# EAGLE board board (EAGLE 9.6.1), part 1 of 2
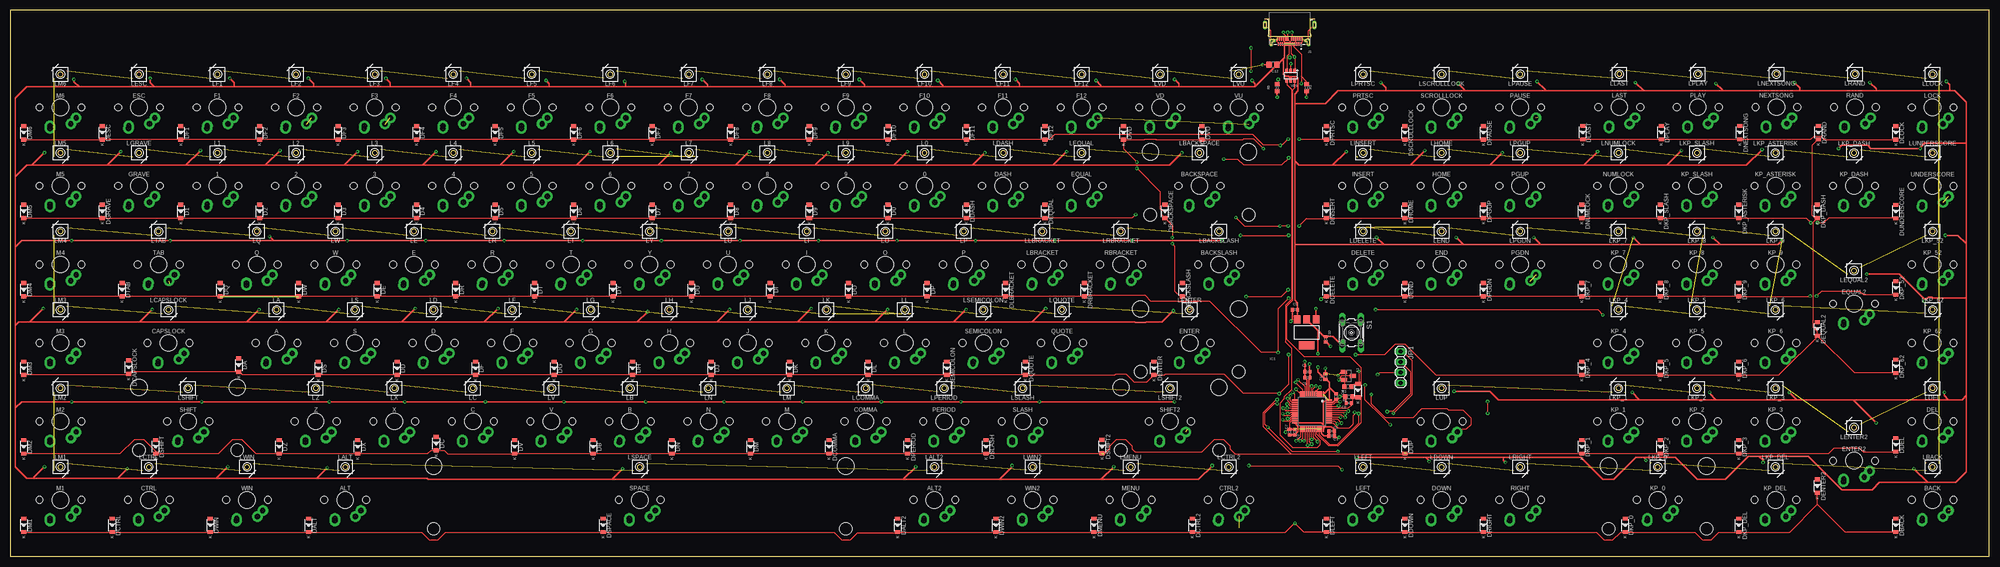
[diagram p5: board, top side]
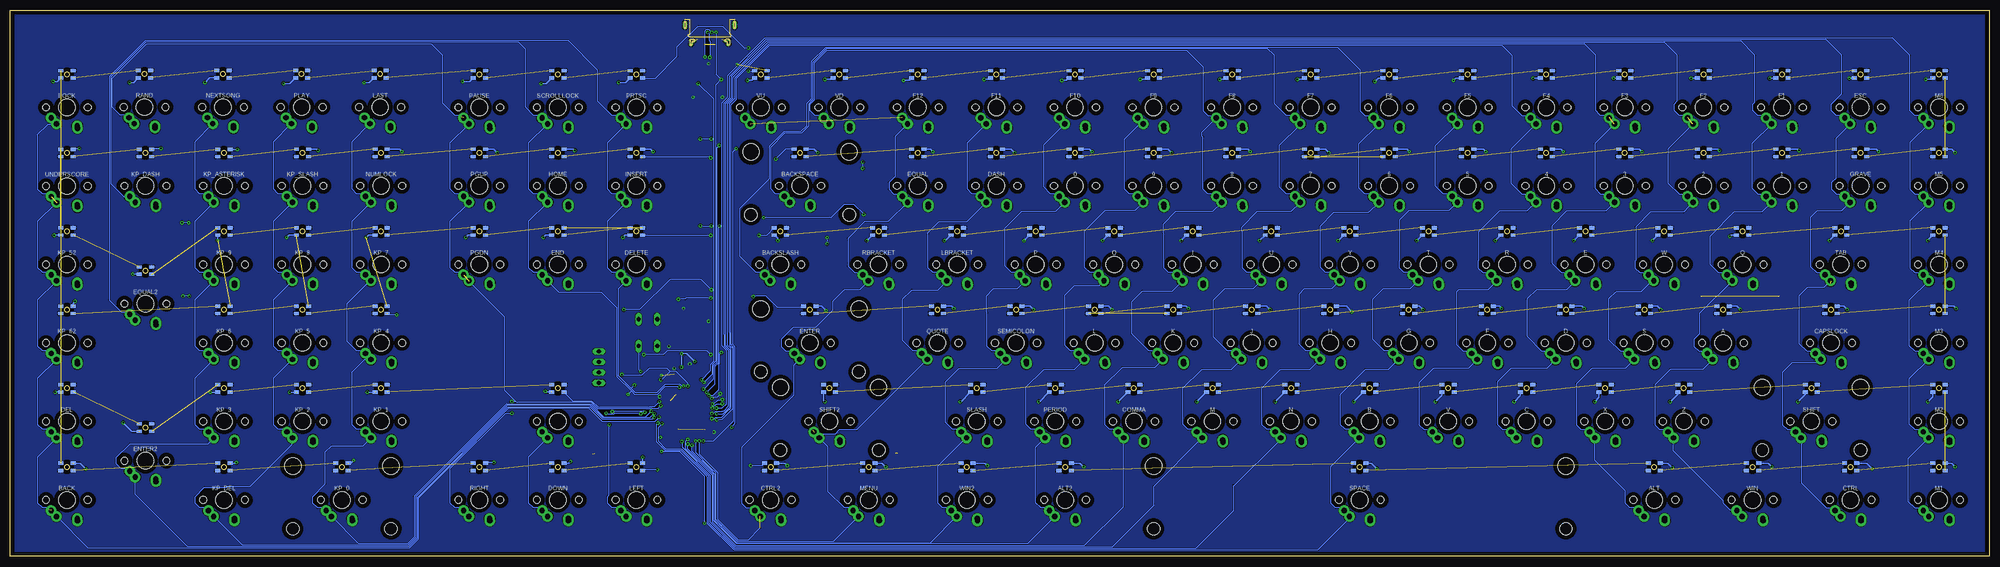
[diagram p6: board, bottom side, seen from below]

Size 479.92 x 132.49 mm. Coordinates in mm from the lower left corner, seen from the top.
Outline: 0,0 479.91,0 479.92,132.49 0.02,132.49 0,0
Copper layers (1*16): Top 0.035mm / dielectric 1.5mm / Bottom 0.035mm
Design rules "default": minimum track width 6mil, minimum drill 0.35mm, track to track 6mil, track to pad 6mil, pad to pad 6mil, via to via 6mil, smd to smd 6mil, copper to edge 40mil, drill to drill 6mil, minimum pad ring 10mil, minimum via ring 8mil, stop-mask expansion 4mil, vias tented up to drill 0mil, thermal gap 10mil
Net classes: 1 POWER: width 0.406 mm

## Footprints (pad centres in the part's own frame; a part is rotated, then mirrored left to right if it is on the bottom)
ALPSMX-1U = drill 1.3 pad 2.54: ALPS1 -2.5,4; ALPS2 2.5,4.5; MX1 -3.81,2.54; MX2 2.54,5.08 | hole 4: 0,0 | hole 1.7: -5.08,0; 5.08,0
ALPSMX-2U = drill 1.3 pad 2.54: ALPS1 -2.5,4; ALPS2 2.5,4.5; MX1 -3.81,2.54; MX2 2.54,5.08 | hole 4: 0,0; -11.9,-8.24; 11.9,-8.24 | hole 1.7: -5.08,0; 5.08,0 | hole 3.05: -11.9,7; 11.9,7
C0402 = smd 0.7 x 0.9: 1 -0.65,0; 2 0.65,0
C0805 = smd 1.3 x 1.5: 1 -0.95,0; 2 0.95,0
SOD-123 = smd 0.91 x 1.22: A -1.635,0; C 1.635,0
SOT223 = smd 1.499 x 2.007: 1 -2.261,-3.15; 2 0.025,-3.15; 3 2.311,-3.15 | smd 3.81 x 2.007: 4 0,3.15
TE_1-2295018-2 = smd 0.3 x 0.8: A1 -2.75,4.63; A2 -2.25,4.63; A3 -1.75,4.63; A4 -1.25,4.63; A5 -0.75,4.63; A6 -0.25,4.63; A7 0.25,4.63; A8 0.75,4.63; A9 1.25,4.63; A10 1.75,4.63; A11 2.25,4.63; A12 2.75,4.63; B1 3,3.43; B2 2.5,3.43; B3 2,3.43; B4 1.5,3.43; B5 1,3.43; B6 0.5,3.43; B7 -0.5,3.43; B8 -1,3.43; B9 -1.5,3.43; B10 -2,3.43; B11 -2.5,3.43; B12 -3,3.43 | drill 0.5 long: P1_1 -4.55,4.22; P2_1 4.55,4.22 | drill 0.35 long: P1_2 -4.191,3.795; P2_2 4.191,3.795 | drill 0.5 pad 1.1 long: P4 -5.97,0; P5 5.97,0
1X04 = drill 1.016 long: 1 -3.81,0; 2 -1.27,0; 3 1.27,0; 4 3.81,0
WS2812B-MINI = smd 0.8 x 1.2 bottom: DIN 0.89,-1.49; DOUT -0.89,1.49; GND -0.89,-1.49; VDD 0.89,1.49
R0603 = smd 1 x 1.1: 1 -0.85,0; 2 0.85,0
B3F-10XX = drill 1.016 long: 1 -3.251,2.261; 2 3.251,2.261; 3 -3.251,-2.261; 4 3.251,-2.261
ALPSMX-6.25U = drill 1.3 pad 2.54: ALPS1 -2.5,4; ALPS2 2.5,4.5; MX1 -3.81,2.54; MX2 2.54,5.08 | hole 4: 0,0; -50,-8.24; 50,-8.24 | hole 1.7: -5.08,0; 5.08,0 | hole 3.05: -50,7; 50,7
SOT23-EBC = smd 1 x 1.4: B 0.95,-1.1; C 0,1.1; E -0.95,-1.1
LQFP48 = smd 1.5 x 0.3: 1 -4.15,2.75; 2 -4.15,2.25; 3 -4.15,1.75; 4 -4.15,1.25; 5 -4.15,0.75; 6 -4.15,0.25; 7 -4.15,-0.25; 8 -4.15,-0.75; 9 -4.15,-1.25; 10 -4.15,-1.75; 11 -4.15,-2.25; 12 -4.15,-2.75; 25 4.15,-2.75; 26 4.15,-2.25; 27 4.15,-1.75; 28 4.15,-1.25; 29 4.15,-0.75; 30 4.15,-0.25; 31 4.15,0.25; 32 4.15,0.75; 33 4.15,1.25; 34 4.15,1.75; 35 4.15,2.25; 36 4.15,2.75 | smd 0.3 x 1.5: 13 -2.75,-4.15; 14 -2.25,-4.15; 15 -1.75,-4.15; 16 -1.25,-4.15; 17 -0.75,-4.15; 18 -0.25,-4.15; 19 0.25,-4.15; 20 0.75,-4.15; 21 1.25,-4.15; 22 1.75,-4.15; 23 2.25,-4.15; 24 2.75,-4.15; 37 2.75,4.15; 38 2.25,4.15; 39 1.75,4.15; 40 1.25,4.15; 41 0.75,4.15; 42 0.25,4.15; 43 -0.25,4.15; 44 -0.75,4.15; 45 -1.25,4.15; 46 -1.75,4.15; 47 -2.25,4.15; 48 -2.75,4.15
SOT-23-6L = smd 0.6 x 1.2: 1 -0.95,-2.3; 2 0,-2.3; 3 0.95,-2.3; 4 0.95,0; 5 0,0; 6 -0.95,0

## Placement (x,y rotation side)
0  KEYSWITCH-PLAIN-ALPSMX-1U  [ALPSMX-1U]  221.71,89.87 180 top
1  KEYSWITCH-PLAIN-ALPSMX-1U  [ALPSMX-1U]  50.26,89.87 180 top
2  KEYSWITCH-PLAIN-ALPSMX-1U  [ALPSMX-1U]  69.31,89.87 180 top
3  KEYSWITCH-PLAIN-ALPSMX-1U  [ALPSMX-1U]  88.36,89.87 180 top
4  KEYSWITCH-PLAIN-ALPSMX-1U  [ALPSMX-1U]  107.41,89.87 180 top
5  KEYSWITCH-PLAIN-ALPSMX-1U  [ALPSMX-1U]  126.46,89.87 180 top
6  KEYSWITCH-PLAIN-ALPSMX-1U  [ALPSMX-1U]  145.51,89.87 180 top
7  KEYSWITCH-PLAIN-ALPSMX-1U  [ALPSMX-1U]  164.56,89.87 180 top
8  KEYSWITCH-PLAIN-ALPSMX-1U  [ALPSMX-1U]  183.61,89.87 180 top
9  KEYSWITCH-PLAIN-ALPSMX-1U  [ALPSMX-1U]  202.66,89.87 180 top
A  KEYSWITCH-PLAIN-ALPSMX-1U  [ALPSMX-1U]  64.55,51.77 180 top
ALT  KEYSWITCH-PLAIN-ALPSMX-1U  [ALPSMX-1U]  81.22,13.67 180 top
ALT2  KEYSWITCH-PLAIN-ALPSMX-1U  [ALPSMX-1U]  224.09,13.67 180 top
B  KEYSWITCH-PLAIN-ALPSMX-1U  [ALPSMX-1U]  150.27,32.72 180 top
BACK  KEYSWITCH-PLAIN-ALPSMX-1U  [ALPSMX-1U]  466.19,13.67 180 top
BACKSLASH  KEYSWITCH-PLAIN-ALPSMX-1U  [ALPSMX-1U]  293.15,70.82 180 top
BACKSPACE  KEYSWITCH-PLAIN-ALPSMX-2U  [ALPSMX-2U]  288.39,89.87 180 top
C  KEYSWITCH-PLAIN-ALPSMX-1U  [ALPSMX-1U]  112.17,32.72 180 top
C1  10nF  [C0402]  314.59,44.77 0 top
C2  100nF  [C0402]  311.48,30.11 90 top
C3  100nF  [C0402]  320.46,29.22 180 top
C4  100nF  [C0402]  321.52,38.75 270 top
C5  1uF  [C0402]  314.59,43.36 0 top
C6  4.7uF  [C0402]  320.45,30.38 180 top
C7  4.7uF  [C0402]  310.29,30.12 90 top
C8  0.1uF  [C0402]  324.62,37.14 180 top
C9  100nF  [C0402]  311.56,59.84 180 top
C10  10uF  [C0402]  318.99,52.63 270 top
C11  100nF  [C0402]  318.92,43.59 90 top
C12  100nF  [C0805]  306.22,119.28 180 top
CAPSLOCK  KEYSWITCH-PLAIN-ALPSMX-1U  [ALPSMX-1U]  38.35,51.77 180 top
COMMA  KEYSWITCH-PLAIN-ALPSMX-1U  [ALPSMX-1U]  207.42,32.72 180 top
CTRL  KEYSWITCH-PLAIN-ALPSMX-1U  [ALPSMX-1U]  33.59,13.67 180 top
CTRL2  KEYSWITCH-PLAIN-ALPSMX-1U  [ALPSMX-1U]  295.53,13.67 180 top
D  KEYSWITCH-PLAIN-ALPSMX-1U  [ALPSMX-1U]  102.65,51.77 180 top
D0  [SOD-123]  212.82,83.71 270 top
D1  [SOD-123]  41.37,83.71 270 top
D2  [SOD-123]  60.42,83.71 270 top
D3  [SOD-123]  79.47,83.71 270 top
D4  [SOD-123]  98.52,83.71 270 top
D5  [SOD-123]  117.57,83.71 270 top
D6  [SOD-123]  136.62,83.71 270 top
D7  [SOD-123]  155.67,83.71 270 top
D8  [SOD-123]  174.72,83.71 270 top
D9  [SOD-123]  193.77,83.71 270 top
D10  4148  [SOD-123]  326.85,40.2 270 top
DA  [SOD-123]  55.41,46.37 270 top
DALT  [SOD-123]  72.33,7.51 270 top
DALT2  [SOD-123]  215.2,7.51 270 top
DASH  KEYSWITCH-PLAIN-ALPSMX-1U  [ALPSMX-1U]  240.76,89.87 180 top
DB  [SOD-123]  141.38,26.56 270 top
DBACK  [SOD-123]  457.3,7.51 270 top
DBACKSLASH  [SOD-123]  284.26,64.66 270 top
DBACKSPACE  [SOD-123]  280.01,83.71 270 top
DC  [SOD-123]  103.28,27.32 270 top
DCAPSLOCK  [SOD-123]  28.7,45.86 270 top
DCOMMA  [SOD-123]  198.53,26.56 270 top
DCTRL  [SOD-123]  24.7,7.51 270 top
DCTRL2  [SOD-123]  286.64,7.51 270 top
DD  [SOD-123]  93.76,45.61 270 top
DDASH  [SOD-123]  231.87,83.71 270 top
DDEL  [SOD-123]  457.3,27.02 270 top
DDELETE  [SOD-123]  319.18,64.66 270 top
DDOWN  [SOD-123]  338.23,7.51 270 top
DE  [SOD-123]  89,64.66 270 top
DEL  KEYSWITCH-PLAIN-ALPSMX-1U  [ALPSMX-1U]  466.19,32.72 180 top
DELETE  KEYSWITCH-PLAIN-ALPSMX-1U  [ALPSMX-1U]  328.07,70.82 180 top
DEND  [SOD-123]  338.23,64.66 270 top
DENTER  [SOD-123]  277.37,45.61 270 top
DENTER2  [SOD-123]  438.25,17.03 270 top
DEQUAL  [SOD-123]  250.92,83.71 270 top
DEQUAL2  [SOD-123]  438.25,55.13 270 top
DESC  [SOD-123]  22.32,102.76 270 top
DF  [SOD-123]  112.81,45.61 270 top
DF1  [SOD-123]  41.37,102.76 270 top
DF2  [SOD-123]  60.42,102.76 270 top
DF3  [SOD-123]  79.47,102.76 270 top
DF4  [SOD-123]  98.52,102.76 270 top
DF5  [SOD-123]  117.57,102.76 270 top
DF6  [SOD-123]  136.62,102.76 270 top
DF7  [SOD-123]  155.67,102.76 270 top
DF8  [SOD-123]  174.72,102.76 270 top
DF9  [SOD-123]  193.77,102.76 270 top
DF10  [SOD-123]  212.82,102.76 270 top
DF11  [SOD-123]  231.87,102.76 270 top
DF12  [SOD-123]  250.92,102.76 270 top
DG  [SOD-123]  131.86,45.61 270 top
DGRAVE  [SOD-123]  22.32,83.71 270 top
DH  [SOD-123]  150.91,45.61 270 top
DHOME  [SOD-123]  338.23,83.71 270 top
DI  [SOD-123]  184.25,64.66 270 top
DINSERT  [SOD-123]  319.18,83.71 270 top
DJ  [SOD-123]  169.96,45.61 270 top
DK  [SOD-123]  189.01,45.61 270 top
DKP_0  [SOD-123]  391.62,7.51 270 top
DKP_1  [SOD-123]  381.1,26.56 270 top
DKP_2  [SOD-123]  400.15,26.56 270 top
DKP_3  [SOD-123]  419.2,26.56 270 top
DKP_4  [SOD-123]  381.1,45.61 270 top
DKP_5  [SOD-123]  400.15,45.61 270 top
DKP_6  [SOD-123]  419.2,45.61 270 top
DKP_7  [SOD-123]  381.1,64.66 270 top
DKP_8  [SOD-123]  400.15,64.66 270 top
DKP_9  [SOD-123]  419.2,64.66 270 top
DKP_52  [SOD-123]  457.3,65.12 270 top
DKP_62  [SOD-123]  457.3,46.07 270 top
DKP_ASTERISK  [SOD-123]  419.2,83.71 270 top
DKP_DASH  [SOD-123]  438.25,83.71 270 top
DKP_DEL  [SOD-123]  419.2,7.51 270 top
DKP_SLASH  [SOD-123]  400.15,83.71 270 top
DL  [SOD-123]  208.06,45.61 270 top
DLAST  [SOD-123]  381.33,102.82 270 top
DLBRACKET  [SOD-123]  241.4,64.66 270 top
DLEFT  [SOD-123]  319.18,7.51 270 top
DLOCK  [SOD-123]  457.3,102.76 270 top
DM  [SOD-123]  179.48,26.56 270 top
DM1  [SOD-123]  3.27,7.51 270 top
DM2  [SOD-123]  3.27,26.56 270 top
DM3  [SOD-123]  3.27,45.61 270 top
DM4  [SOD-123]  3.27,64.66 270 top
DM5  [SOD-123]  3.27,83.71 270 top
DM6  [SOD-123]  3.27,102.76 270 top
DMENU  [SOD-123]  262.83,7.51 270 top
DN  [SOD-123]  160.43,26.56 270 top
DNEXTSONG  [SOD-123]  419.43,102.82 270 top
DNUMLOCK  [SOD-123]  381.1,83.71 270 top
DO  [SOD-123]  203.3,64.66 270 top
DOWN  KEYSWITCH-PLAIN-ALPSMX-1U  [ALPSMX-1U]  347.12,13.67 180 top
DP  [SOD-123]  222.35,64.66 270 top
DPAUSE  [SOD-123]  357.28,102.76 270 top
DPERIOD  [SOD-123]  217.58,26.56 270 top
DPGDN  [SOD-123]  357.28,64.66 270 top
DPGUP  [SOD-123]  357.28,83.71 270 top
DPLAY  [SOD-123]  400.38,102.82 270 top
DPRTSC  [SOD-123]  319.18,102.76 270 top
DQ  [SOD-123]  50.9,64.66 270 top
DQUOTE  [SOD-123]  246.16,45.61 270 top
DR  [SOD-123]  108.05,64.66 270 top
DRAND  [SOD-123]  438.48,102.82 270 top
DRBRACKET  [SOD-123]  260.45,64.66 270 top
DRIGHT  [SOD-123]  357.28,7.51 270 top
DS  [SOD-123]  74.71,45.61 270 top
DSCROLLLOCK  [SOD-123]  338.23,102.76 270 top
DSEMICOLON  [SOD-123]  227.11,45.61 270 top
DSHIFT  [SOD-123]  35.25,26.56 270 top
DSHIFT2  [SOD-123]  264.79,26.6 270 top
DSLASH  [SOD-123]  236.63,26.56 270 top
DSPACE  [SOD-123]  143.76,7.51 270 top
DT  [SOD-123]  127.1,64.66 270 top
DTAB  [SOD-123]  27.08,64.66 270 top
DU  [SOD-123]  165.2,64.66 270 top
DUNDERSCORE  [SOD-123]  457.3,83.67 270 top
DUP  [SOD-123]  338.23,26.56 270 top
DV  [SOD-123]  122.33,26.56 270 top
DVD  [SOD-123]  269.97,102.76 270 top
DVU  [SOD-123]  289.02,102.76 270 top
DW  [SOD-123]  69.95,64.66 270 top
DWIN  [SOD-123]  48.51,7.51 270 top
DWIN2  [SOD-123]  239.01,7.51 270 top
DX  [SOD-123]  84.23,26.56 270 top
DY  [SOD-123]  146.15,64.66 270 top
DZ  [SOD-123]  65.18,26.56 270 top
E  KEYSWITCH-PLAIN-ALPSMX-1U  [ALPSMX-1U]  97.89,70.82 180 top
END  KEYSWITCH-PLAIN-ALPSMX-1U  [ALPSMX-1U]  347.12,70.82 180 top
ENTER  KEYSWITCH-PLAIN-ALPSMX-2U  [ALPSMX-2U]  286,51.77 180 top
ENTER2  KEYSWITCH-PLAIN-ALPSMX-1U  [ALPSMX-1U]  447.14,23.19 180 top
EQUAL  KEYSWITCH-PLAIN-ALPSMX-1U  [ALPSMX-1U]  259.81,89.87 180 top
EQUAL2  KEYSWITCH-PLAIN-ALPSMX-1U  [ALPSMX-1U]  447.14,61.29 180 top
ESC  KEYSWITCH-PLAIN-ALPSMX-1U  [ALPSMX-1U]  31.21,108.92 180 top
F  KEYSWITCH-PLAIN-ALPSMX-1U  [ALPSMX-1U]  121.7,51.77 180 top
F1  KEYSWITCH-PLAIN-ALPSMX-1U  [ALPSMX-1U]  50.26,108.92 180 top
F2  KEYSWITCH-PLAIN-ALPSMX-1U  [ALPSMX-1U]  69.31,108.92 180 top
F3  KEYSWITCH-PLAIN-ALPSMX-1U  [ALPSMX-1U]  88.36,108.92 180 top
F4  KEYSWITCH-PLAIN-ALPSMX-1U  [ALPSMX-1U]  107.41,108.92 180 top
F5  KEYSWITCH-PLAIN-ALPSMX-1U  [ALPSMX-1U]  126.46,108.92 180 top
F6  KEYSWITCH-PLAIN-ALPSMX-1U  [ALPSMX-1U]  145.51,108.92 180 top
F7  KEYSWITCH-PLAIN-ALPSMX-1U  [ALPSMX-1U]  164.56,108.92 180 top
F8  KEYSWITCH-PLAIN-ALPSMX-1U  [ALPSMX-1U]  183.61,108.92 180 top
F9  KEYSWITCH-PLAIN-ALPSMX-1U  [ALPSMX-1U]  202.66,108.92 180 top
F10  KEYSWITCH-PLAIN-ALPSMX-1U  [ALPSMX-1U]  221.71,108.92 180 top
F11  KEYSWITCH-PLAIN-ALPSMX-1U  [ALPSMX-1U]  240.76,108.92 180 top
F12  KEYSWITCH-PLAIN-ALPSMX-1U  [ALPSMX-1U]  259.81,108.92 180 top
G  KEYSWITCH-PLAIN-ALPSMX-1U  [ALPSMX-1U]  140.75,51.77 180 top
GRAVE  KEYSWITCH-PLAIN-ALPSMX-1U  [ALPSMX-1U]  31.21,89.87 180 top
H  KEYSWITCH-PLAIN-ALPSMX-1U  [ALPSMX-1U]  159.8,51.77 180 top
HOME  KEYSWITCH-PLAIN-ALPSMX-1U  [ALPSMX-1U]  347.12,89.87 180 top
I  KEYSWITCH-PLAIN-ALPSMX-1U  [ALPSMX-1U]  193.14,70.82 180 top
IC1  REG1117  [SOT223]  314.42,54.32 180 top
INSERT  KEYSWITCH-PLAIN-ALPSMX-1U  [ALPSMX-1U]  328.07,89.87 180 top
J  KEYSWITCH-PLAIN-ALPSMX-1U  [ALPSMX-1U]  178.85,51.77 180 top
J1  1-2295018-2  [TE_1-2295018-2]  310.29,128.93 180 top
JP1  [1X04]  337.21,45.87 270 top
K  KEYSWITCH-PLAIN-ALPSMX-1U  [ALPSMX-1U]  197.9,51.77 180 top
KP_0  KEYSWITCH-PLAIN-ALPSMX-2U  [ALPSMX-2U]  399.51,13.67 180 top
KP_1  KEYSWITCH-PLAIN-ALPSMX-1U  [ALPSMX-1U]  389.99,32.72 180 top
KP_2  KEYSWITCH-PLAIN-ALPSMX-1U  [ALPSMX-1U]  409.04,32.72 180 top
KP_3  KEYSWITCH-PLAIN-ALPSMX-1U  [ALPSMX-1U]  428.09,32.72 180 top
KP_4  KEYSWITCH-PLAIN-ALPSMX-1U  [ALPSMX-1U]  389.99,51.77 180 top
KP_5  KEYSWITCH-PLAIN-ALPSMX-1U  [ALPSMX-1U]  409.04,51.77 180 top
KP_6  KEYSWITCH-PLAIN-ALPSMX-1U  [ALPSMX-1U]  428.09,51.77 180 top
KP_7  KEYSWITCH-PLAIN-ALPSMX-1U  [ALPSMX-1U]  389.99,70.82 180 top
KP_8  KEYSWITCH-PLAIN-ALPSMX-1U  [ALPSMX-1U]  409.04,70.82 180 top
KP_9  KEYSWITCH-PLAIN-ALPSMX-1U  [ALPSMX-1U]  428.09,70.82 180 top
KP_52  KEYSWITCH-PLAIN-ALPSMX-1U  [ALPSMX-1U]  466.19,70.82 180 top
KP_62  KEYSWITCH-PLAIN-ALPSMX-1U  [ALPSMX-1U]  466.19,51.77 180 top
KP_ASTERISK  KEYSWITCH-PLAIN-ALPSMX-1U  [ALPSMX-1U]  428.09,89.87 180 top
KP_DASH  KEYSWITCH-PLAIN-ALPSMX-1U  [ALPSMX-1U]  447.14,89.87 180 top
KP_DEL  KEYSWITCH-PLAIN-ALPSMX-1U  [ALPSMX-1U]  428.09,13.67 180 top
KP_SLASH  KEYSWITCH-PLAIN-ALPSMX-1U  [ALPSMX-1U]  409.04,89.87 180 top
L  KEYSWITCH-PLAIN-ALPSMX-1U  [ALPSMX-1U]  216.95,51.77 180 top
L0  WS2812B-MINI  [WS2812B-MINI]  221.71,97.89 90 top
L1  WS2812B-MINI  [WS2812B-MINI]  50.26,97.89 90 top
L2  WS2812B-MINI  [WS2812B-MINI]  69.31,97.89 90 top
L3  WS2812B-MINI  [WS2812B-MINI]  88.36,97.89 90 top
L4  WS2812B-MINI  [WS2812B-MINI]  107.41,97.89 90 top
L5  WS2812B-MINI  [WS2812B-MINI]  126.46,97.89 90 top
L6  WS2812B-MINI  [WS2812B-MINI]  145.51,97.89 90 top
L7  WS2812B-MINI  [WS2812B-MINI]  164.56,97.89 90 top
L8  WS2812B-MINI  [WS2812B-MINI]  183.61,97.89 90 top
L9  WS2812B-MINI  [WS2812B-MINI]  202.66,97.89 90 top
LA  WS2812B-MINI  [WS2812B-MINI]  64.55,59.79 90 top
LALT  WS2812B-MINI  [WS2812B-MINI]  81.22,21.69 90 top
LALT2  WS2812B-MINI  [WS2812B-MINI]  224.09,21.69 90 top
LAST  KEYSWITCH-PLAIN-ALPSMX-1U  [ALPSMX-1U]  390.22,108.98 180 top
LB  WS2812B-MINI  [WS2812B-MINI]  150.27,40.74 270 top
LBACK  WS2812B-MINI  [WS2812B-MINI]  466.19,21.69 90 top
LBACKSLASH  WS2812B-MINI  [WS2812B-MINI]  293.15,78.84 270 top
LBACKSPACE  WS2812B-MINI  [WS2812B-MINI]  288.39,97.89 90 top
LBRACKET  KEYSWITCH-PLAIN-ALPSMX-1U  [ALPSMX-1U]  250.29,70.82 180 top
LC  WS2812B-MINI  [WS2812B-MINI]  112.17,40.74 270 top
LCAPSLOCK  WS2812B-MINI  [WS2812B-MINI]  38.35,59.79 90 top
LCOMMA  WS2812B-MINI  [WS2812B-MINI]  207.42,40.74 270 top
LCTRL  WS2812B-MINI  [WS2812B-MINI]  33.59,21.69 90 top
LCTRL2  WS2812B-MINI  [WS2812B-MINI]  295.53,21.69 90 top
LD  WS2812B-MINI  [WS2812B-MINI]  102.65,59.79 90 top
LDASH  WS2812B-MINI  [WS2812B-MINI]  240.76,97.89 90 top
LDEL  WS2812B-MINI  [WS2812B-MINI]  466.19,40.74 270 top
LDELETE  WS2812B-MINI  [WS2812B-MINI]  328.07,78.84 270 top
LDOWN  WS2812B-MINI  [WS2812B-MINI]  347.12,21.69 90 top
LE  WS2812B-MINI  [WS2812B-MINI]  97.89,78.84 270 top
LEFT  KEYSWITCH-PLAIN-ALPSMX-1U  [ALPSMX-1U]  328.07,13.67 180 top
LEND  WS2812B-MINI  [WS2812B-MINI]  347.12,78.84 270 top
LENTER  WS2812B-MINI  [WS2812B-MINI]  286,59.79 90 top
LENTER2  WS2812B-MINI  [WS2812B-MINI]  447.14,31.21 270 top
LEQUAL  WS2812B-MINI  [WS2812B-MINI]  259.81,97.89 90 top
LEQUAL2  WS2812B-MINI  [WS2812B-MINI]  447.14,69.31 270 top
LESC  WS2812B-MINI  [WS2812B-MINI]  31.21,116.94 270 top
LF  WS2812B-MINI  [WS2812B-MINI]  121.7,59.79 90 top
LF1  WS2812B-MINI  [WS2812B-MINI]  50.26,116.94 270 top
LF2  WS2812B-MINI  [WS2812B-MINI]  69.31,116.94 270 top
LF3  WS2812B-MINI  [WS2812B-MINI]  88.36,116.94 270 top
LF4  WS2812B-MINI  [WS2812B-MINI]  107.41,116.94 270 top
LF5  WS2812B-MINI  [WS2812B-MINI]  126.46,116.94 270 top
LF6  WS2812B-MINI  [WS2812B-MINI]  145.51,116.94 270 top
LF7  WS2812B-MINI  [WS2812B-MINI]  164.56,116.94 270 top
LF8  WS2812B-MINI  [WS2812B-MINI]  183.61,116.94 270 top
LF9  WS2812B-MINI  [WS2812B-MINI]  202.66,116.94 270 top
LF10  WS2812B-MINI  [WS2812B-MINI]  221.71,116.94 270 top
LF11  WS2812B-MINI  [WS2812B-MINI]  240.76,116.94 270 top
LF12  WS2812B-MINI  [WS2812B-MINI]  259.81,116.94 270 top
LG  WS2812B-MINI  [WS2812B-MINI]  140.75,59.79 90 top
LGRAVE  WS2812B-MINI  [WS2812B-MINI]  31.21,97.89 90 top
LH  WS2812B-MINI  [WS2812B-MINI]  159.8,59.79 90 top
LHOME  WS2812B-MINI  [WS2812B-MINI]  347.12,97.89 90 top
LI  WS2812B-MINI  [WS2812B-MINI]  193.14,78.84 270 top
LINSERT  WS2812B-MINI  [WS2812B-MINI]  328.07,97.89 90 top
LJ  WS2812B-MINI  [WS2812B-MINI]  178.85,59.79 90 top
LK  WS2812B-MINI  [WS2812B-MINI]  197.9,59.79 90 top
LKP_0  WS2812B-MINI  [WS2812B-MINI]  399.51,21.69 90 top
LKP_1  WS2812B-MINI  [WS2812B-MINI]  389.99,40.74 270 top
LKP_2  WS2812B-MINI  [WS2812B-MINI]  409.04,40.74 270 top
LKP_3  WS2812B-MINI  [WS2812B-MINI]  428.09,40.74 270 top
LKP_4  WS2812B-MINI  [WS2812B-MINI]  389.99,59.79 90 top
LKP_5  WS2812B-MINI  [WS2812B-MINI]  409.04,59.79 90 top
LKP_6  WS2812B-MINI  [WS2812B-MINI]  428.09,59.79 90 top
LKP_7  WS2812B-MINI  [WS2812B-MINI]  389.99,78.84 270 top
LKP_8  WS2812B-MINI  [WS2812B-MINI]  409.04,78.84 270 top
LKP_9  WS2812B-MINI  [WS2812B-MINI]  428.09,78.84 270 top
LKP_52  WS2812B-MINI  [WS2812B-MINI]  466.19,78.84 270 top
LKP_62  WS2812B-MINI  [WS2812B-MINI]  466.19,59.79 90 top
LKP_ASTERISK  WS2812B-MINI  [WS2812B-MINI]  428.09,97.85 90 top
LKP_DASH  WS2812B-MINI  [WS2812B-MINI]  447.14,97.85 90 top
LKP_DEL  WS2812B-MINI  [WS2812B-MINI]  428.09,21.69 90 top
LKP_SLASH  WS2812B-MINI  [WS2812B-MINI]  409.04,97.89 90 top
LL  WS2812B-MINI  [WS2812B-MINI]  216.95,59.79 90 top
LLAST  WS2812B-MINI  [WS2812B-MINI]  390.22,117 270 top
LLBRACKET  WS2812B-MINI  [WS2812B-MINI]  250.29,78.84 270 top
LLEFT  WS2812B-MINI  [WS2812B-MINI]  328.07,21.69 90 top
LLOCK  WS2812B-MINI  [WS2812B-MINI]  466.19,116.94 270 top
LM  WS2812B-MINI  [WS2812B-MINI]  188.37,40.74 270 top
LM1  WS2812B-MINI  [WS2812B-MINI]  12.16,21.69 90 top
LM2  WS2812B-MINI  [WS2812B-MINI]  12.16,40.74 270 top
LM3  WS2812B-MINI  [WS2812B-MINI]  12.16,59.79 90 top
LM4  WS2812B-MINI  [WS2812B-MINI]  12.16,78.84 270 top
LM5  WS2812B-MINI  [WS2812B-MINI]  12.16,97.89 90 top
LM6  WS2812B-MINI  [WS2812B-MINI]  12.16,116.94 270 top
LMENU  WS2812B-MINI  [WS2812B-MINI]  271.72,21.69 90 top
LN  WS2812B-MINI  [WS2812B-MINI]  169.32,40.74 270 top
LNEXTSONG  WS2812B-MINI  [WS2812B-MINI]  428.32,117 270 top
LNUMLOCK  WS2812B-MINI  [WS2812B-MINI]  389.99,97.89 90 top
LO  WS2812B-MINI  [WS2812B-MINI]  212.19,78.84 270 top
LOCK  KEYSWITCH-PLAIN-ALPSMX-1U  [ALPSMX-1U]  466.19,108.92 180 top
LP  WS2812B-MINI  [WS2812B-MINI]  231.24,78.84 270 top
LPAUSE  WS2812B-MINI  [WS2812B-MINI]  366.17,116.94 270 top
LPERIOD  WS2812B-MINI  [WS2812B-MINI]  226.47,40.74 270 top
LPGDN  WS2812B-MINI  [WS2812B-MINI]  366.17,78.84 270 top
LPGUP  WS2812B-MINI  [WS2812B-MINI]  366.17,97.89 90 top
LPLAY  WS2812B-MINI  [WS2812B-MINI]  409.27,117 270 top
LPRTSC  WS2812B-MINI  [WS2812B-MINI]  328.07,116.94 270 top
LQ  WS2812B-MINI  [WS2812B-MINI]  59.79,78.84 270 top
LQUOTE  WS2812B-MINI  [WS2812B-MINI]  255.05,59.79 90 top
LR  WS2812B-MINI  [WS2812B-MINI]  116.94,78.84 270 top
LRAND  WS2812B-MINI  [WS2812B-MINI]  447.37,117 270 top
LRBRACKET  WS2812B-MINI  [WS2812B-MINI]  269.34,78.84 270 top
LRIGHT  WS2812B-MINI  [WS2812B-MINI]  366.17,21.69 90 top
LS  WS2812B-MINI  [WS2812B-MINI]  83.6,59.79 90 top
LSCROLLLOCK  WS2812B-MINI  [WS2812B-MINI]  347.12,116.94 270 top
LSEMICOLON  WS2812B-MINI  [WS2812B-MINI]  236,59.79 90 top
LSHIFT  WS2812B-MINI  [WS2812B-MINI]  43.12,40.74 270 top
LSHIFT2  WS2812B-MINI  [WS2812B-MINI]  281.24,40.74 270 top
LSLASH  WS2812B-MINI  [WS2812B-MINI]  245.52,40.74 270 top
LSPACE  WS2812B-MINI  [WS2812B-MINI]  152.65,21.69 90 top
LT  WS2812B-MINI  [WS2812B-MINI]  135.99,78.84 270 top
LTAB  WS2812B-MINI  [WS2812B-MINI]  35.97,78.84 270 top
LU  WS2812B-MINI  [WS2812B-MINI]  174.09,78.84 270 top
LUNDERSCORE  WS2812B-MINI  [WS2812B-MINI]  466.19,97.85 90 top
LUP  WS2812B-MINI  [WS2812B-MINI]  347.12,40.74 270 top
LV  WS2812B-MINI  [WS2812B-MINI]  131.22,40.74 270 top
LVD  WS2812B-MINI  [WS2812B-MINI]  278.86,116.94 270 top
LVU  WS2812B-MINI  [WS2812B-MINI]  297.91,116.94 270 top
LW  WS2812B-MINI  [WS2812B-MINI]  78.84,78.84 270 top
LWIN  WS2812B-MINI  [WS2812B-MINI]  57.4,21.69 90 top
LWIN2  WS2812B-MINI  [WS2812B-MINI]  247.9,21.69 90 top
LX  WS2812B-MINI  [WS2812B-MINI]  93.12,40.74 270 top
LY  WS2812B-MINI  [WS2812B-MINI]  155.04,78.84 270 top
LZ  WS2812B-MINI  [WS2812B-MINI]  74.07,40.74 270 top
M  KEYSWITCH-PLAIN-ALPSMX-1U  [ALPSMX-1U]  188.37,32.72 180 top
M1  KEYSWITCH-PLAIN-ALPSMX-1U  [ALPSMX-1U]  12.16,13.67 180 top
M2  KEYSWITCH-PLAIN-ALPSMX-1U  [ALPSMX-1U]  12.16,32.72 180 top
M3  KEYSWITCH-PLAIN-ALPSMX-1U  [ALPSMX-1U]  12.16,51.77 180 top
M4  KEYSWITCH-PLAIN-ALPSMX-1U  [ALPSMX-1U]  12.16,70.82 180 top
M5  KEYSWITCH-PLAIN-ALPSMX-1U  [ALPSMX-1U]  12.16,89.87 180 top
M6  KEYSWITCH-PLAIN-ALPSMX-1U  [ALPSMX-1U]  12.16,108.92 180 top
MENU  KEYSWITCH-PLAIN-ALPSMX-1U  [ALPSMX-1U]  271.72,13.67 180 top
N  KEYSWITCH-PLAIN-ALPSMX-1U  [ALPSMX-1U]  169.32,32.72 180 top
NEXTSONG  KEYSWITCH-PLAIN-ALPSMX-1U  [ALPSMX-1U]  428.32,108.98 180 top
NUMLOCK  KEYSWITCH-PLAIN-ALPSMX-1U  [ALPSMX-1U]  389.99,89.87 180 top
O  KEYSWITCH-PLAIN-ALPSMX-1U  [ALPSMX-1U]  212.19,70.82 180 top
P  KEYSWITCH-PLAIN-ALPSMX-1U  [ALPSMX-1U]  231.24,70.82 180 top
PAUSE  KEYSWITCH-PLAIN-ALPSMX-1U  [ALPSMX-1U]  366.17,108.92 180 top
PERIOD  KEYSWITCH-PLAIN-ALPSMX-1U  [ALPSMX-1U]  226.47,32.72 180 top
PGDN  KEYSWITCH-PLAIN-ALPSMX-1U  [ALPSMX-1U]  366.17,70.82 180 top
PGUP  KEYSWITCH-PLAIN-ALPSMX-1U  [ALPSMX-1U]  366.17,89.87 180 top
PLAY  KEYSWITCH-PLAIN-ALPSMX-1U  [ALPSMX-1U]  409.27,108.98 180 top
PRTSC  KEYSWITCH-PLAIN-ALPSMX-1U  [ALPSMX-1U]  328.07,108.92 180 top
Q  KEYSWITCH-PLAIN-ALPSMX-1U  [ALPSMX-1U]  59.79,70.82 180 top
QUOTE  KEYSWITCH-PLAIN-ALPSMX-1U  [ALPSMX-1U]  255.05,51.77 180 top
R  KEYSWITCH-PLAIN-ALPSMX-1U  [ALPSMX-1U]  116.94,70.82 180 top
R1  4.7k  [R0603]  324.41,41.18 180 top
R2  10k  [R0603]  324.61,38.69 0 top
R3  5.1k  [R0603]  314.35,113.69 270 top
R5  5.1k  [R0603]  307.24,113.69 270 top
RAND  KEYSWITCH-PLAIN-ALPSMX-1U  [ALPSMX-1U]  447.37,108.98 180 top
RBRACKET  KEYSWITCH-PLAIN-ALPSMX-1U  [ALPSMX-1U]  269.34,70.82 180 top
RIGHT  KEYSWITCH-PLAIN-ALPSMX-1U  [ALPSMX-1U]  366.17,13.67 180 top
S  KEYSWITCH-PLAIN-ALPSMX-1U  [ALPSMX-1U]  83.6,51.77 180 top
S1  [B3F-10XX]  325.27,54.25 270 top
SCROLLLOCK  KEYSWITCH-PLAIN-ALPSMX-1U  [ALPSMX-1U]  347.12,108.92 180 top
SEMICOLON  KEYSWITCH-PLAIN-ALPSMX-1U  [ALPSMX-1U]  236,51.77 180 top
SHIFT  KEYSWITCH-PLAIN-ALPSMX-2U  [ALPSMX-2U]  43.12,32.72 180 top
SHIFT2  KEYSWITCH-PLAIN-ALPSMX-2U  [ALPSMX-2U]  281.24,32.72 180 top
SLASH  KEYSWITCH-PLAIN-ALPSMX-1U  [ALPSMX-1U]  245.52,32.72 180 top
SPACE  KEYSWITCH-PLAIN-ALPSMX-6.25U  [ALPSMX-6.25U]  152.65,13.67 180 top
T  KEYSWITCH-PLAIN-ALPSMX-1U  [ALPSMX-1U]  135.99,70.82 180 top
T1  [SOT23-EBC]  324.52,43.76 270 top
TAB  KEYSWITCH-PLAIN-ALPSMX-1U  [ALPSMX-1U]  35.97,70.82 180 top
U  KEYSWITCH-PLAIN-ALPSMX-1U  [ALPSMX-1U]  174.09,70.82 180 top
U$1  STM32F072-LQFP48  [LQFP48]  315.68,35.11 270 top
UNDERSCORE  KEYSWITCH-PLAIN-ALPSMX-1U  [ALPSMX-1U]  466.19,89.83 180 top
UP  KEYSWITCH-PLAIN-ALPSMX-1U  [ALPSMX-1U]  347.12,32.72 180 top
V  KEYSWITCH-PLAIN-ALPSMX-1U  [ALPSMX-1U]  131.22,32.72 180 top
VD  KEYSWITCH-PLAIN-ALPSMX-1U  [ALPSMX-1U]  278.86,108.92 180 top
VD1  [SOT-23-6L]  310.54,115.47 180 top
VU  KEYSWITCH-PLAIN-ALPSMX-1U  [ALPSMX-1U]  297.91,108.92 180 top
W  KEYSWITCH-PLAIN-ALPSMX-1U  [ALPSMX-1U]  78.84,70.82 180 top
WIN  KEYSWITCH-PLAIN-ALPSMX-1U  [ALPSMX-1U]  57.4,13.67 180 top
WIN2  KEYSWITCH-PLAIN-ALPSMX-1U  [ALPSMX-1U]  247.9,13.67 180 top
X  KEYSWITCH-PLAIN-ALPSMX-1U  [ALPSMX-1U]  93.12,32.72 180 top
Y  KEYSWITCH-PLAIN-ALPSMX-1U  [ALPSMX-1U]  155.04,70.82 180 top
Z  KEYSWITCH-PLAIN-ALPSMX-1U  [ALPSMX-1U]  74.07,32.72 180 top